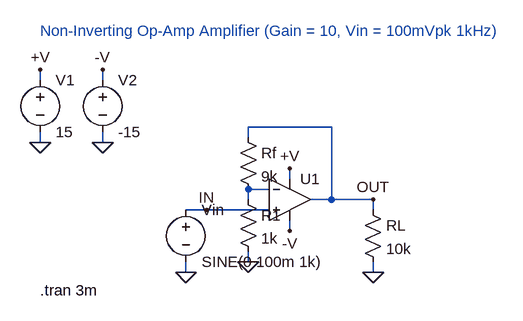
[diagram p0: schematic amplifier.asc]
amplifier.asc, the LTspice schematic file:
Version 4
SHEET 1 1200 800
WIRE 128 200 128 216
WIRE 128 312 128 296
WIRE 224 200 224 216
WIRE 224 312 224 296
WIRE 352 416 480 416
WIRE 352 512 352 496
WIRE 512 352 512 368
WIRE 512 448 512 432
WIRE 448 288 576 288
WIRE 448 304 448 288
WIRE 448 384 480 384
WIRE 448 400 448 384
WIRE 448 496 448 480
WIRE 544 400 576 400
WIRE 576 400 640 400
WIRE 576 400 576 288
WIRE 640 416 640 400
WIRE 640 512 640 496
FLAG 128 200 +V
FLAG 128 312 0
FLAG 224 200 -V
FLAG 224 312 0
FLAG 352 512 0
FLAG 384 416 IN
FLAG 512 352 +V
FLAG 512 448 -V
FLAG 448 496 0
FLAG 640 400 OUT
FLAG 640 512 0
SYMBOL voltage 128 200 R0
WINDOW 123 0 0 Left 0
WINDOW 39 0 0 Left 0
SYMATTR InstName V1
SYMATTR Value 15
SYMBOL voltage 224 200 R0
WINDOW 123 0 0 Left 0
WINDOW 39 0 0 Left 0
SYMATTR InstName V2
SYMATTR Value -15
SYMBOL voltage 352 400 R0
WINDOW 123 0 0 Left 0
WINDOW 39 0 0 Left 0
SYMATTR InstName Vin
SYMATTR Value SINE(0 100m 1k)
SYMBOL res 432 288 R0
SYMATTR InstName Rf
SYMATTR Value 9k
SYMBOL res 432 384 R0
SYMATTR InstName R1
SYMATTR Value 1k
SYMBOL res 624 400 R0
SYMATTR InstName RL
SYMATTR Value 10k
SYMBOL UniversalOpAmp2 512 400 R0
SYMATTR InstName U1
TEXT 128 540 Left 2 !.tran 3m
TEXT 128 140 Left 2 ;Non-Inverting Op-Amp Amplifier (Gain = 10, Vin = 100mVpk 1kHz)

The netlist it stands for:
* amplifier.asc
V1 +V 0 15
V2 -V 0 -15
Vin IN 0 SINE(0 100m 1k)
Rf OUT N001 9k
R1 N001 0 1k
RL OUT 0 10k
XU1 IN N001 +V -V OUT level2 Avol=1Meg GBW=10Meg Slew=10Meg Ilimit=25m Rail=0 Vos=0 En=0 Enk=0 In=0 Ink=0 Rin=500Meg  ; pins In+ In- V+ V- OUT
.tran 3m
* Non-Inverting Op-Amp Amplifier (Gain = 10, Vin = 100mVpk 1kHz)
.lib UniversalOpAmp2.lib
.backanno
.end